# EAGLE design Headphone Amplifier (EAGLE 7.7.0)
AUTHOR: Nathan Campos; REVISION: A
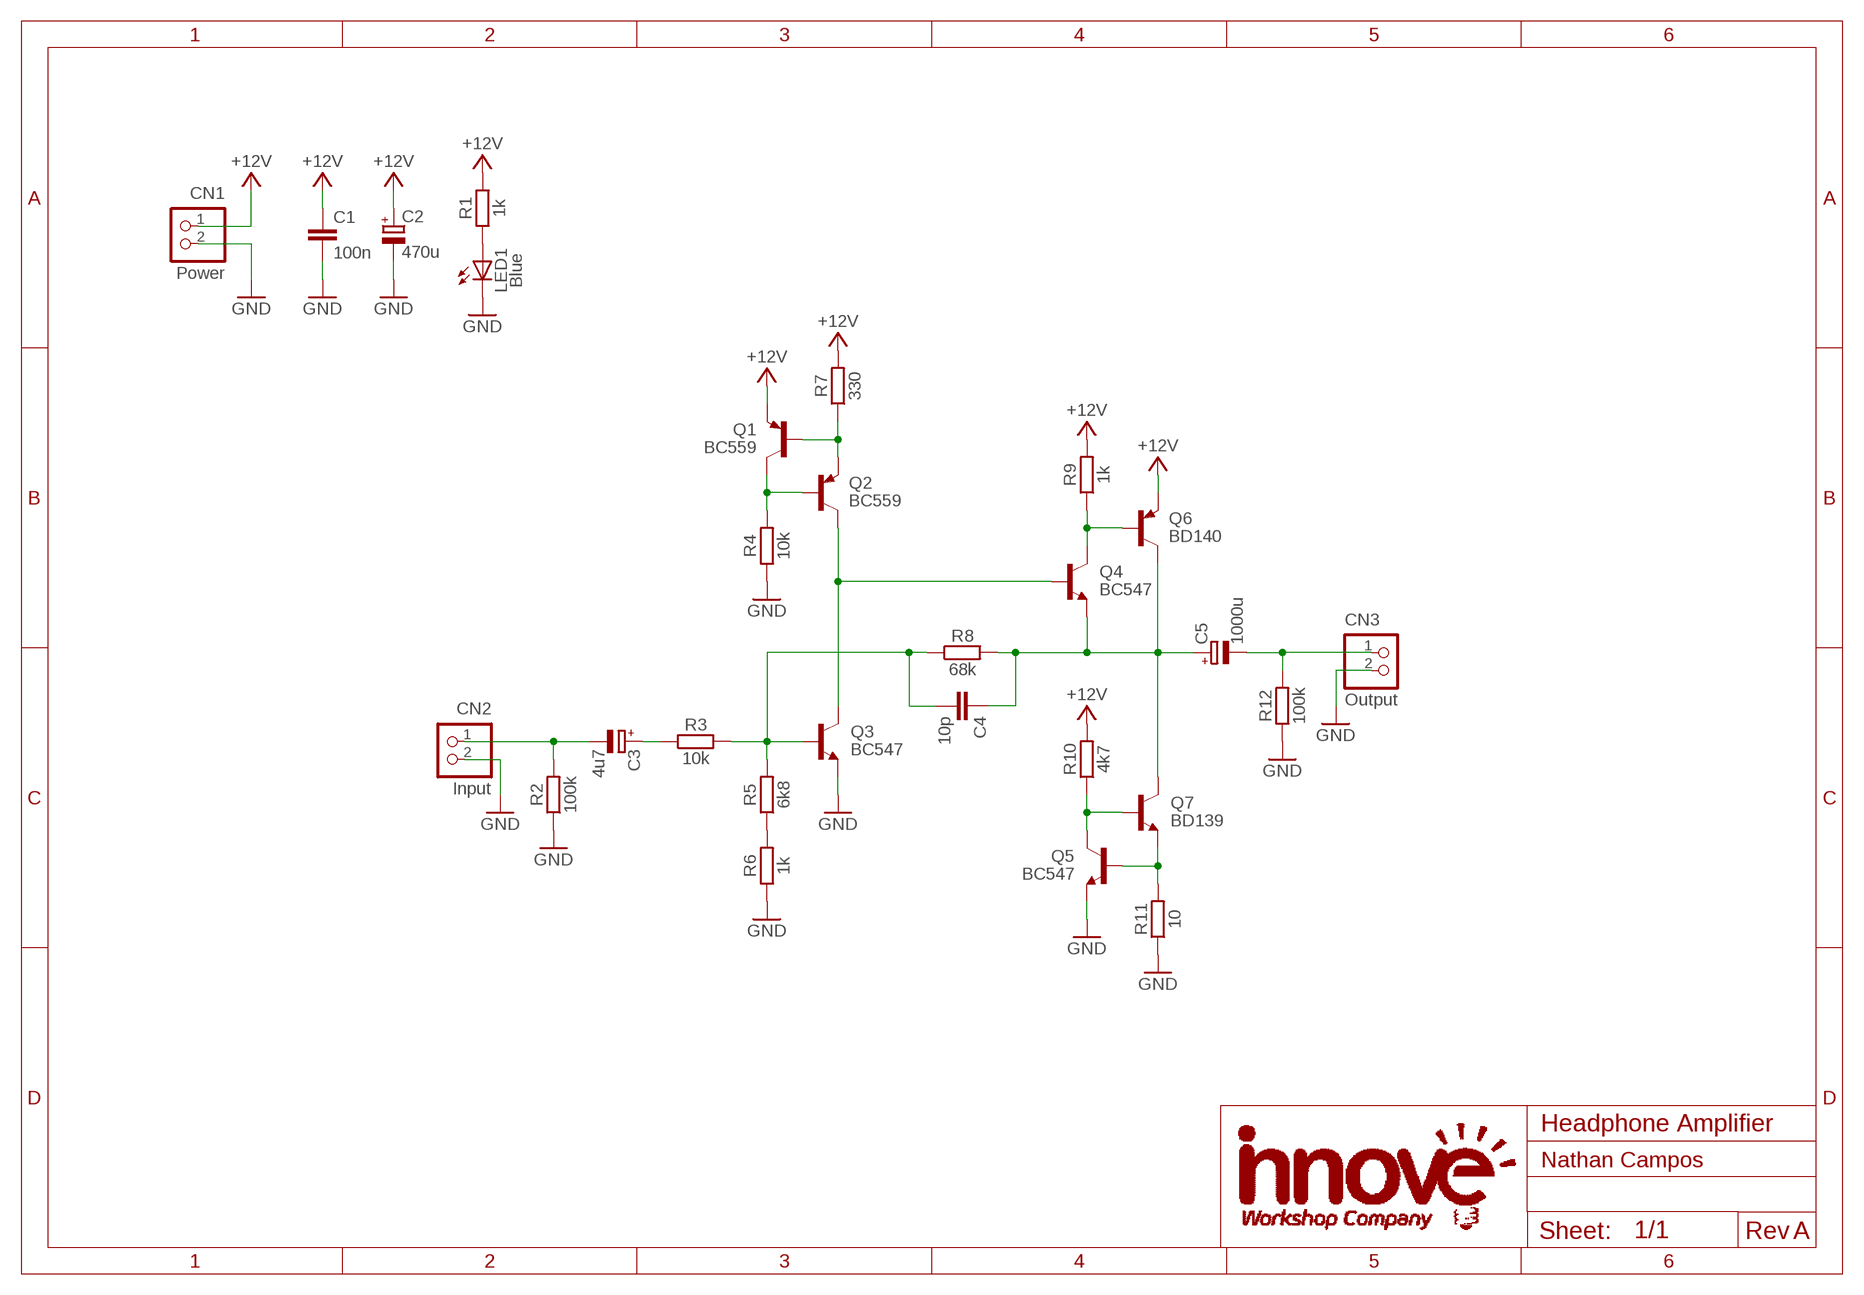
[diagram p0: schematic, sheet 1]

## Parts
C1  100n  C5.0-2.5X7.5  [C050-025X075]
C2  470u  CPOL-E5-10  [E5-10]
C3  4u7  CPOL-E1.8-4  [E1,8-4]
C4  10p  C5.0-2.5X7.5  [C050-025X075]
C5  1000u  CPOL-E5-10  [E5-10]
CN1  Power  B2B-XH-A  [B2B-XH-A]
CN2  Input  B2B-XH-A  [B2B-XH-A]
CN3  Output  B2B-XH-A  [B2B-XH-A]
LED1  Blue  LED5MM  [LED5MM]
Q1  BC559  [TO92]
Q2  BC559  [TO92]
Q3  BC547  [TO92]
Q4  BC547  [TO92]
Q5  BC547  [TO92]
Q6  BD140  [TO126V]
Q7  BD139  [TO126V]
R1  1k  RT0207  [0207/10]
R2  100k  RT0207  [0207/10]
R3  10k  RT0207  [0207/10]
R4  10k  RT0207  [0207/10]
R5  6k8  RT0207  [0207/10]
R6  1k  RT0207  [0207/10]
R7  330  RT0207  [0207/10]
R8  68k  RT0207  [0207/10]
R9  1k  RT0207  [0207/10]
R10  4k7  RT0207  [0207/10]
R11  10  RT0207  [0207/10]
R12  100k  RT0207  [0207/10]

## Nets
+12V: C1.1 C2.+ CN1.1 Q1.3(E) Q6.1(E) R1.2 R7.2 R9.2 R10.2
DCOUTPUT: C4.1 C5.+ Q4.3(E) Q6.2(C) Q7.2(C) R8.2
GND: C1.2 C2.- CN1.2 CN2.2 CN3.2 LED1.K(C) Q3.3(E) Q5.3(E) R2.1 R4.1 R6.1 R11.1 R12.1
INPUT: C3.- CN2.1 R2.2
INTSTAGE: Q2.1(C) Q3.1(C) Q4.2(B)
N$1: R5.1 R6.2
N$2: C3.+ R3.1
N$3: LED1.A R1.1
N$4: Q1.1(C) Q2.2(B) R4.2
N$5: Q1.2(B) Q2.3(E) R7.1
N$6: Q4.1(C) Q6.3(B) R9.1
N$8: Q5.1(C) Q7.3(B) R10.1
N$9: Q5.2(B) Q7.1(E) R11.2
NFB: C4.2 Q3.2(B) R3.2 R5.2 R8.1
OUTPUT: C5.- CN3.1 R12.2

## Library data of the parts
C1 C4 = innove-passives:C: Ceramic Capacitor Those little yellow/brown things
C2 C3 C5 = innove-passives:CPOL: Polarized Capacitor May come in the electrolytic and tantalum variants
CN1-CN3 = innove-con-jst-xh:B2B-XH-A: Wire-to-Board 2.5mm pitch top mount connector Source: http://www.jst-mfg.com/product/pdf/jpn/XH.pdf http://www.jst-mfg.com/product/detail.php?series=277
LED1 = innove-leds:LED: LED OSRAM: - CHIPLED LG R971, LG N971, LY N971, LG Q971, LY Q971, LO R971, LY R971 LH N974, LH R974 LS Q976, LO Q976, LY Q976 LO Q996 - Hyper CHIPLED LW Q18S LB Q993, LB Q99A, LB R99A - SideLED LS A670, LO A670, LY A670, LG A670, LP A670 LB A673, LV A673, LT A673, LW A673 LH A674 LY A675 LS A676, LA A676, LO A676, LY A676, LW A676 LS A679, LY A679, LG A679 - Hyper Micro SIDELED® LS Y876, LA Y876, LO Y876, LY Y876 LT Y87S - SmartLED LW L88C, LW L88S LB L89C, LB L89S, LG L890 LS L89K, LO L89K, LY L89K LS L896, LA L896, LO L896, LY L896 - TOPLED LS T670, LO T670, LY T670, LG T670, LP T670 LSG T670, LSP T670, LSY T670, LOP T670, LYG T670 LG T671, LOG T671, LSG T671 LB T673, LV T673, LT T673, LW T673 LH T674 LS T676, LA T676, LO T676, LY T676, LB T676, LH T676, LSB T676, LW T676 LB T67C, LV T67C, LT T67C, LS T67K, LO T67K, LY T67K, LW E67C LS E67B, LA E67B, LO E67B, LY E67B, LB E67C, LV E67C, LT E67C LW T67C LS T679, LY T679, LG T679 LS T770, LO T770, LY T770, LG T770, LP T770 LB T773, LV T773, LT T773, LW T773 LH T774 LS E675, LA E675, LY E675, LS T675 LS T776, LA T776, LO T776, LY T776, LB T776 LHGB T686 LT T68C, LB T68C - Hyper Mini TOPLED® LB M676 - Mini TOPLED Santana® LG M470 LS M47K, LO M47K, LY M47K Source: http://www.osram.convergy.de LUXEON: - LUMILED® LXK2-PW12-R00, LXK2-PW12-S00, LXK2-PW14-U00, LXK2-PW14-V00 LXK2-PM12-R00, LXK2-PM12-S00, LXK2-PM14-U00 LXK2-PE12-Q00, LXK2-PE12-R00, LXK2-PE12-S00, LXK2-PE14-T00, LXK2-PE14-U00 LXK2-PB12-K00, LXK2-PB12-L00, LXK2-PB12-M00, LXK2-PB14-N00, LXK2-PB14-P00, LXK2-PB14-Q00 LXK2-PR12-L00, LXK2-PR12-M00, LXK2-PR14-Q00, LXK2-PR14-R00 LXK2-PD12-Q00, LXK2-PD12-R00, LXK2-PD12-S00 LXK2-PH12-R00, LXK2-PH12-S00 LXK2-PL12-P00, LXK2-PL12-Q00, LXK2-PL12-R00 Source: www.luxeon.com KINGBRIGHT: KA-3528ASYC Source: www.kingbright.com
Q1 Q2 = innove-bjts:BC559
Q3-Q5 = innove-bjts:BC547
Q6 = innove-bjts:BD140
Q7 = innove-bjts:BD139
R1-R12 = innove-passives:R: Resistor This is officially the most boring component ever.

## Board
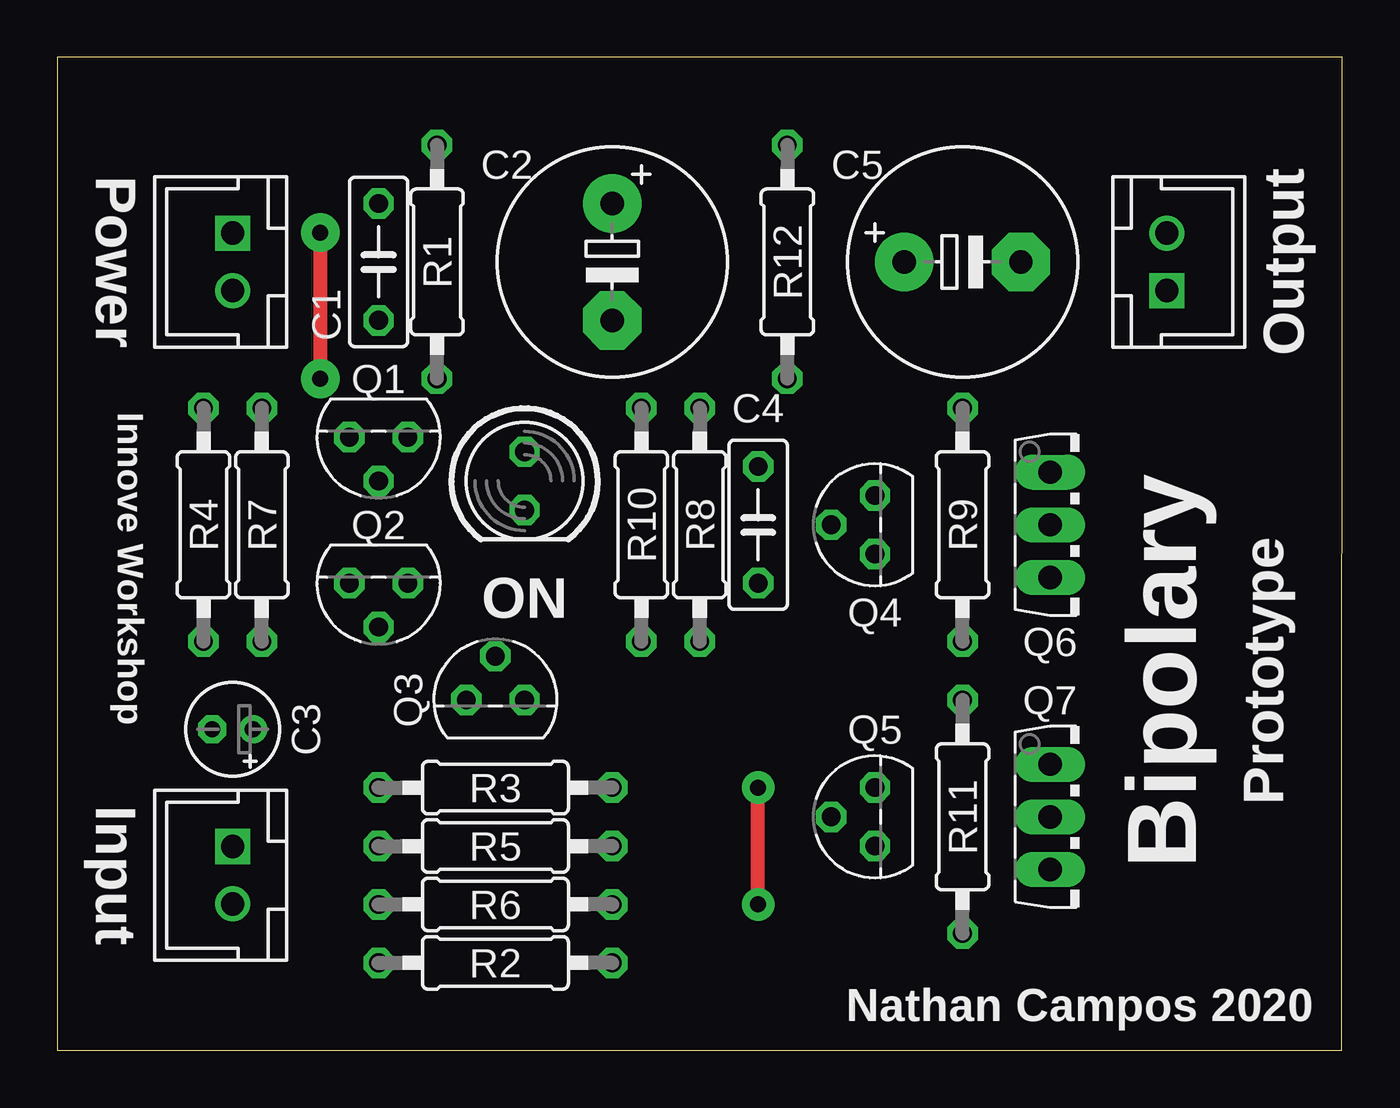
[diagram p1: board, top side]
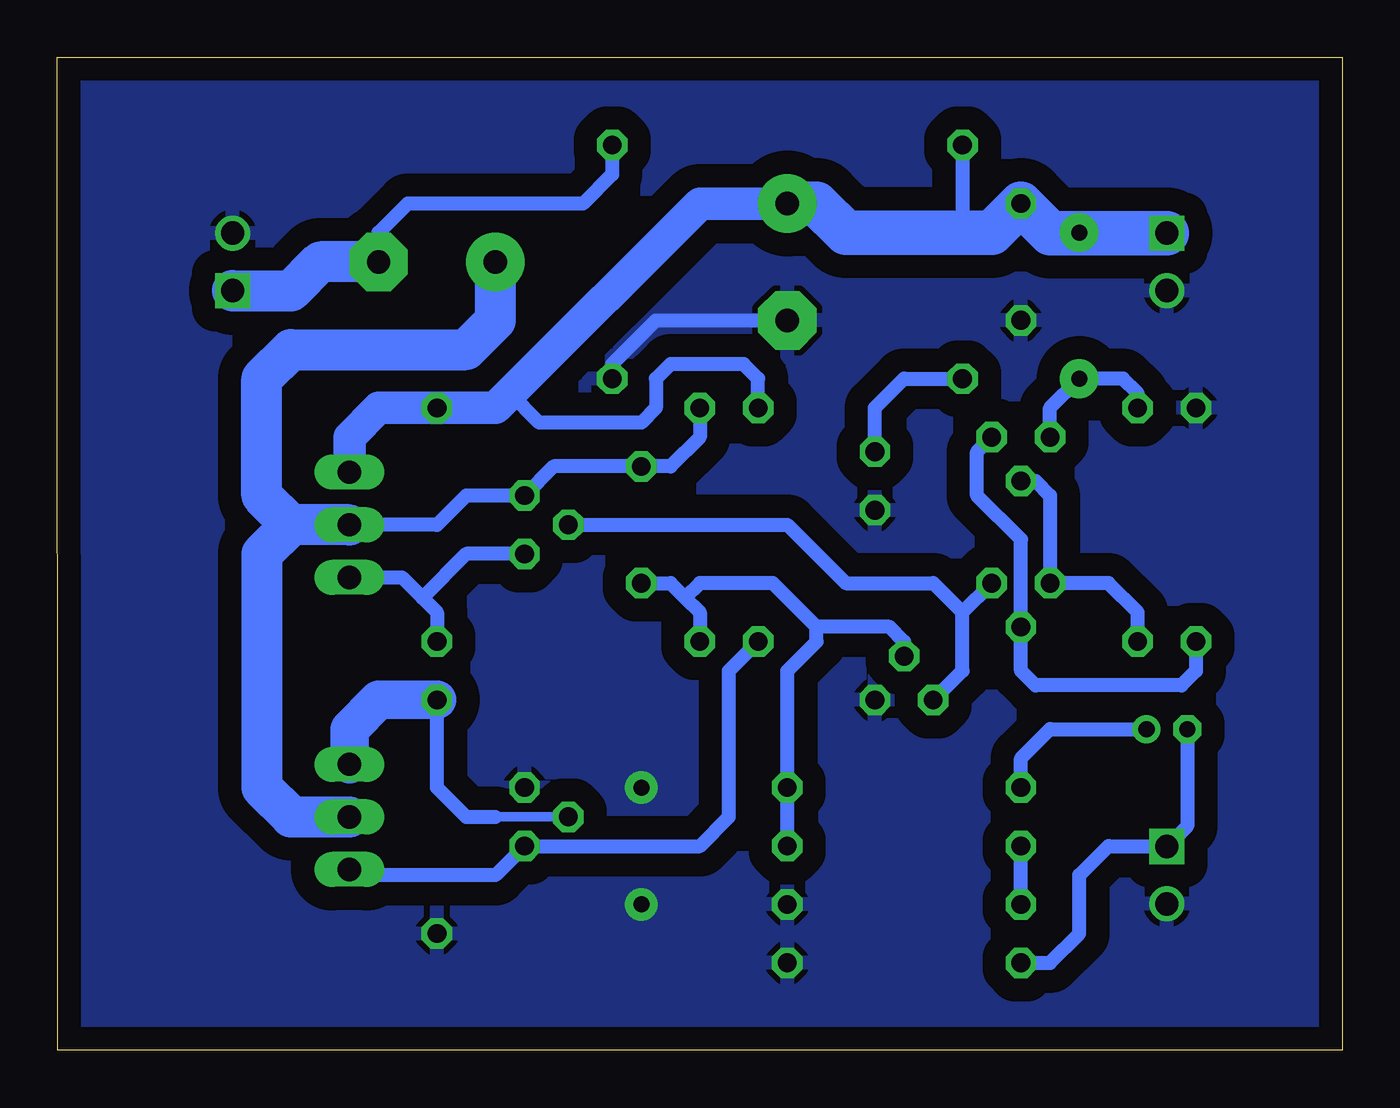
[diagram p2: board, bottom side, seen from below]

Size 55.88 x 43.18 mm. Coordinates in mm from the lower left corner, seen from the top.
Outline: 0,0 55.86,0 55.88,43.18 0,43.18 0,0
Copper layers (1*16): Top 0.035mm / dielectric 1.5mm / Bottom 0.035mm
Design rules "toner-transfer *": minimum track width 16mil, minimum drill 0.5mm, track to track 6mil, track to pad 6mil, pad to pad 6mil, via to via 6mil, smd to smd 0mil, copper to edge 1mm, drill to drill 1mm, minimum pad ring 10mil, minimum via ring 6mil, stop-mask expansion 2mil, vias tented up to drill 100mil, thermal gap 10mil

### Footprints (pad centres in the part's own frame; a part is rotated, then mirrored left to right if it is on the bottom)
C050-025X075 = drill 0.813 octagon: 1 -2.54,0; 2 2.54,0
E5-10 = drill 1.016 pad 2.54: + -2.54,0 | drill 1.016 pad 2.54 octagon: - 2.54,0
E1,8-4 = drill 0.711 pad 1.168: + -0.889,0 | drill 0.711 pad 1.168 octagon: - 0.889,0
B2B-XH-A = drill 1.016 square: 1 -1.25,0 | drill 1.016: 2 1.25,0
LED5MM = drill 0.813 octagon: A -1.27,0; K 1.27,0
TO92 = drill 0.813 octagon: 1 -1.27,0; 2 0,1.905; 3 1.27,0
TO126V = drill 1.016 long: 1 -2.286,-1.27; 2 0,-1.27; 3 2.286,-1.27
0207/10 = drill 0.813 octagon: 1 -5.08,0; 2 5.08,0

### Placement (x,y rotation side)
C1  13.97,34.29 270 top
C2  24.13,34.29 270 top
C3  7.62,13.97 180 top
C4  30.48,22.86 270 top
C5  39.37,34.29 0 top
CN1  7.62,34.29 270 top
CN2  7.62,7.62 270 top
CN3  48.26,34.29 90 top
LED1  20.32,24.77 270 top
Q1  13.97,26.67 180 top
Q2  13.97,20.32 180 top
Q3  19.05,15.24 0 top
Q4  35.56,22.86 90 top
Q5  35.56,10.16 90 top
Q6  44.45,22.86 270 top
Q7  44.45,10.16 270 top
R1  16.51,34.29 90 top
R2  19.05,3.81 180 top
R3  19.05,11.43 0 top
R4  6.35,22.86 270 top
R5  19.05,8.89 0 top
R6  19.05,6.35 180 top
R7  8.89,22.86 90 top
R8  27.94,22.86 90 top
R9  39.37,22.86 90 top
R10  25.4,22.86 90 top
R11  39.37,10.16 90 top
R12  31.75,34.29 90 top

### Tracks (layer width: path | path; a pad name or v marks a point on that pad's centre or on a via)
+12V  (via drill 0.7 pad 1.68)
  Top 0.61: v11.43,35.56 v11.43,29.21
  Bottom 0.61: R1.2 16.51,35.56 | R10.2 25.4,29.21 26.04,29.84 29.21,29.84 29.84,29.21 29.84,27.94 30.48,27.3 34.92,27.3 36.2,28.57 | Q1.3 12.7,27.94 v11.43,29.21 9.53,29.21 8.89,28.57 R7.2 | v11.43,35.56 7.64,35.56 CN1.1
  Bottom 1.422: Q6.1 43.18,26.67 41.91,27.94 R9.2 36.83,27.94 36.2,28.57 27.94,36.83 C2.+
  Bottom 1.93: CN1.1 12.68,35.54 C1.1 15.24,35.56 16.51,35.56 21.59,35.56 22.86,36.83 C2.+
DCOUTPUT
  Bottom 0.61: R8.2 27.94,26.67 29.21,25.4 C4.1 34.29,25.4 Q4.3 38.1,24.13 39.37,22.86 Q6.2
  Bottom 1.778: 45.72,22.86 46.99,24.13 46.99,29.21 45.72,30.48 38.1,30.48 36.83,31.75 C5.+ | Q6.2 45.72,22.86 | 45.72,22.86 46.99,21.59 46.99,11.43 45.72,10.16 Q7.2
GND  (via drill 0.7 pad 1.42)
  Top 0.61: v30.48,6.35 v30.48,11.43
  Bottom 0.61: R12.1 31.75,29.84 29.84,31.75 C2.-
  pour Bottom (isolate 1.016): 0,43.18 55.88,43.18 55.88,0 0,0
INPUT
  Bottom 0.61: C3.- 6.73,9.76 CN2.1 7.64,8.89 10.16,8.89 11.43,7.62 11.43,5.08 12.7,3.81 R2.2
INTSTAGE
  Bottom 0.61: Q3.1 16.51,16.51 16.51,19.05 | 16.51,19.05 Q2.1 | Q4.2 24.13,22.86 21.59,20.32 17.78,20.32 16.51,19.05
N$1
  Bottom 0.61: R6.2 R5.1
N$2
  Bottom 0.61: R3.1 13.97,12.7 12.7,13.97 C3.+
N$3
  Bottom 0.61: LED1.A 20.32,27.94 19.05,29.21 R1.1
N$4
  Bottom 0.61: Q1.1 15.88,26.04 15.88,24.13 13.97,22.23 Q2.2 13.97,16.51 13.34,15.88 6.99,15.88 6.35,16.51 R4.2
N$5
  Bottom 0.61: Q1.2 13.34,24.77 12.7,24.13 Q2.3 10.16,20.32 8.89,19.05 R7.1
N$6
  Bottom 0.61: Q6.3 40.89,20.57 40.01,19.68 | 40.01,19.68 39.37,19.05 R9.1 | Q4.1 38.1,21.59 40.01,19.68
N$8
  Bottom 0.61: Q7.3 42.93,7.62 36.83,7.62 Q5.1 27.94,8.89 26.67,10.16 26.67,16.51 R10.1
N$9
  Bottom 0.406: Q5.2 36.83,10.16
  Bottom 0.61: R11.2 39.37,11.43 38.1,10.16 36.83,10.16
  Bottom 1.676: Q7.1 43.18,13.97 41.91,15.24 R11.2
NFB
  Bottom 0.61: C4.2 29.21,20.32 28.57,19.68 | 28.57,19.68 27.94,19.05 R8.1 | Q3.2 19.05,17.78 19.68,18.41 22.86,18.41 | 22.86,18.41 24.77,20.32 27.94,20.32 28.57,19.68 | 22.86,18.41 22.86,17.78 24.13,16.51 R3.2 R5.2
OUTPUT
  Bottom 0.61: R12.2 31.75,38.1 33.02,36.83 40.64,36.83 41.91,35.56 C5.-
  Bottom 1.778: C5.- 44.45,34.29 45.72,33.02 48.24,33.02 CN3.1

### Text on the board
tPlace: Power | Output | Innove Workshop | ON | Bipolary | Prototype | Input | Nathan Campos 2020